# Altium schematic sheet [08] algorythm.SchDoc
size 381 x 177 mm
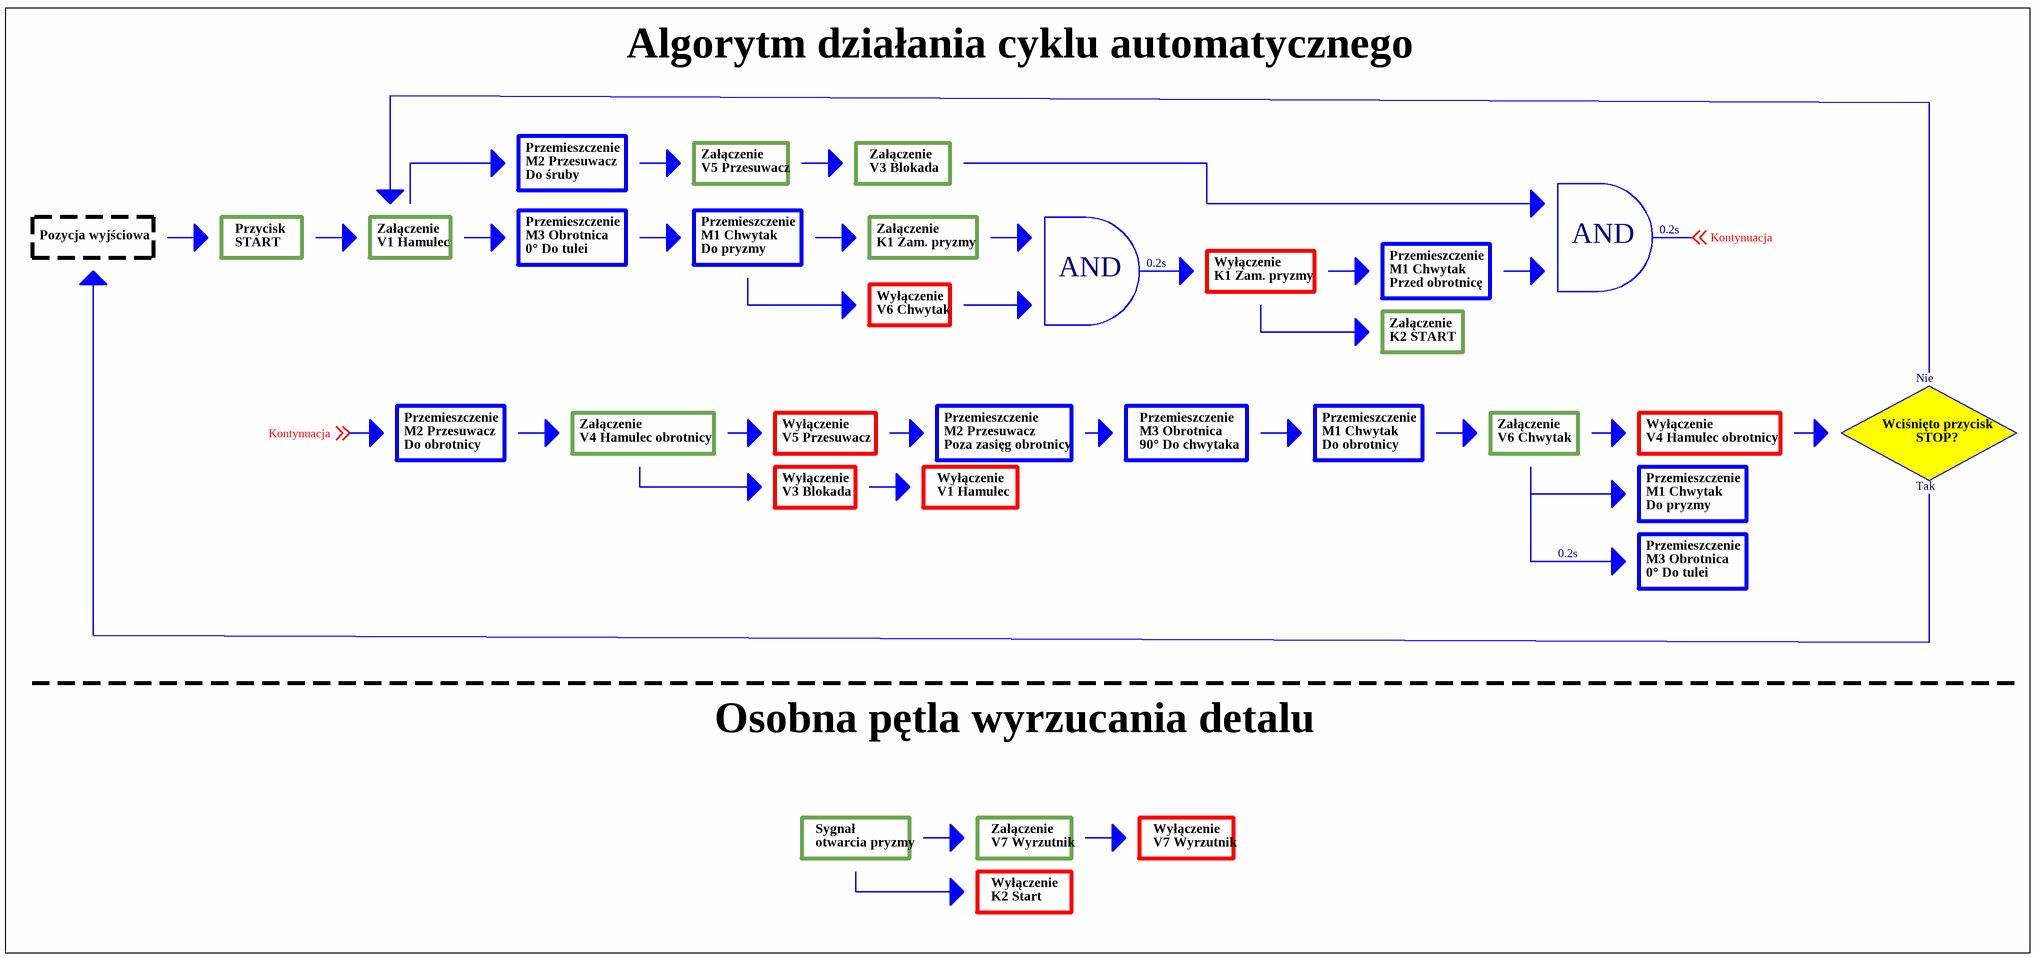
[diagram p0: [08] algorythm.SchDoc]

## Notes on the sheet
- Algorytm działania cyklu automatycznego
- Przemieszczenie
- M2 Przesuwacz
- Załączenie
- V5 Przesuwacz
- V3 Blokada
- Przycisk
- Do śruby
- 0.2s
- Pozycja wyjściowa
- START
- V1 Hamulec
- M3 Obrotnica
- 0° Do tulei
- M1 Chwytak
- Do pryzmy
- K1 Zam. pryzmy
- Wyłączenie
- AND
- Przed obrotnicę
- V6 Chwytak
- K2 START
- V4 Hamulec obrotnicy
- Wciśnięto przycisk
- STOP?
- Nie
- Do obrotnicy
- Poza zasięg obrotnicy
- 90° Do chwytaka
- Tak
- Osobna pętla wyrzucania detalu
- Sygnał
- otwarcia pryzmy
- V7 Wyrzutnik
- K2 Start
- Labels drawn without touching a wire or pin: Kontynuacja